# EAGLE design moja-col (EAGLE 6.4)
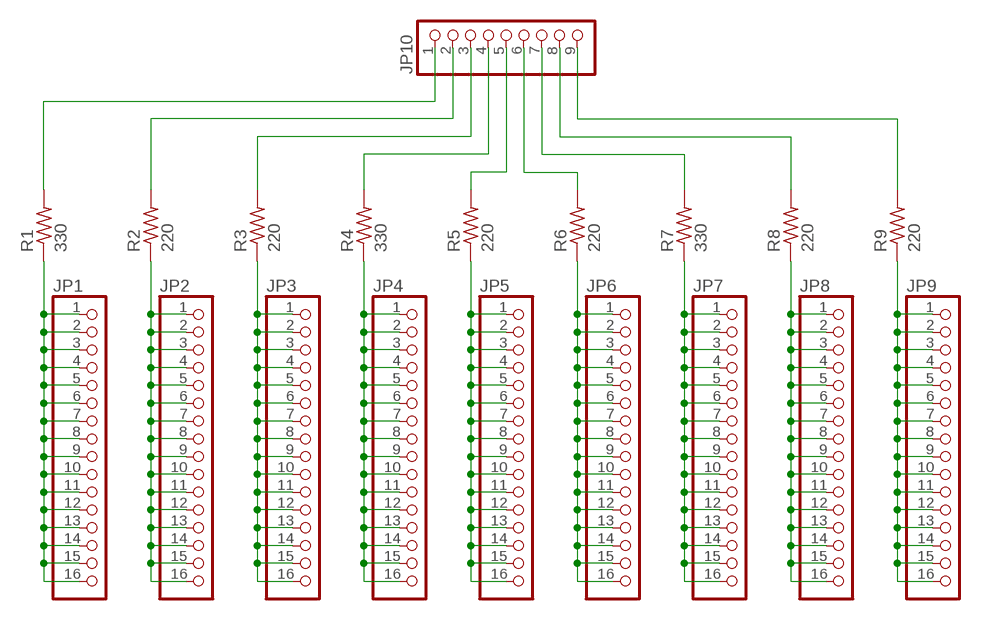
[diagram p0: schematic, sheet 1]

## Parts
JP1  PINHD-1X16  [1X16]
JP2  PINHD-1X16  [1X16]
JP3  PINHD-1X16  [1X16]
JP4  PINHD-1X16  [1X16]
JP5  PINHD-1X16  [1X16]
JP6  PINHD-1X16  [1X16]
JP7  PINHD-1X16  [1X16]
JP8  PINHD-1X16  [1X16]
JP9  PINHD-1X16  [1X16]
JP10  PINHD-1X9  [1X09]
R1  330  R-US_0204/2V  [0204V]
R2  220  R-US_0204/2V  [0204V]
R3  220  R-US_0204/2V  [0204V]
R4  330  R-US_0204/2V  [0204V]
R5  220  R-US_0204/2V  [0204V]
R6  220  R-US_0204/2V  [0204V]
R7  330  R-US_0204/2V  [0204V]
R8  220  R-US_0204/2V  [0204V]
R9  220  R-US_0204/2V  [0204V]

## Nets
N$1: JP1.1 JP1.2 JP1.3 JP1.4 JP1.5 JP1.6 JP1.7 JP1.8 JP1.9 JP1.10 JP1.11 JP1.12 JP1.13 JP1.14 JP1.15 JP1.16 R1.1
N$2: JP2.1 JP2.2 JP2.3 JP2.4 JP2.5 JP2.6 JP2.7 JP2.8 JP2.9 JP2.10 JP2.11 JP2.12 JP2.13 JP2.14 JP2.15 JP2.16 R2.1
N$3: JP3.1 JP3.2 JP3.3 JP3.4 JP3.5 JP3.6 JP3.7 JP3.8 JP3.9 JP3.10 JP3.11 JP3.12 JP3.13 JP3.14 JP3.15 JP3.16 R3.1
N$4: JP4.1 JP4.2 JP4.3 JP4.4 JP4.5 JP4.6 JP4.7 JP4.8 JP4.9 JP4.10 JP4.11 JP4.12 JP4.13 JP4.14 JP4.15 JP4.16 R4.1
N$5: JP5.1 JP5.2 JP5.3 JP5.4 JP5.5 JP5.6 JP5.7 JP5.8 JP5.9 JP5.10 JP5.11 JP5.12 JP5.13 JP5.14 JP5.15 JP5.16 R5.1
N$6: JP6.1 JP6.2 JP6.3 JP6.4 JP6.5 JP6.6 JP6.7 JP6.8 JP6.9 JP6.10 JP6.11 JP6.12 JP6.13 JP6.14 JP6.15 JP6.16 R6.1
N$7: JP7.1 JP7.2 JP7.3 JP7.4 JP7.5 JP7.6 JP7.7 JP7.8 JP7.9 JP7.10 JP7.11 JP7.12 JP7.13 JP7.14 JP7.15 JP7.16 R7.1
N$8: JP8.1 JP8.2 JP8.3 JP8.4 JP8.5 JP8.6 JP8.7 JP8.8 JP8.9 JP8.10 JP8.11 JP8.12 JP8.13 JP8.14 JP8.15 JP8.16 R8.1
N$9: JP9.1 JP9.2 JP9.3 JP9.4 JP9.5 JP9.6 JP9.7 JP9.8 JP9.9 JP9.10 JP9.11 JP9.12 JP9.13 JP9.14 JP9.15 JP9.16 R9.1
N$10: JP10.1 R1.2
N$11: JP10.2 R2.2
N$12: JP10.3 R3.2
N$13: JP10.4 R4.2
N$14: JP10.5 R5.2
N$15: JP10.6 R6.2
N$16: JP10.7 R7.2
N$17: JP10.8 R8.2
N$18: JP10.9 R9.2

## Library data of the parts
JP1-JP9 = pinhead:PINHD-1X16: PIN HEADER
JP10 = pinhead:PINHD-1X9: PIN HEADER
R1-R9 = resistor:R-US_: RESISTOR, American symbol

## Board
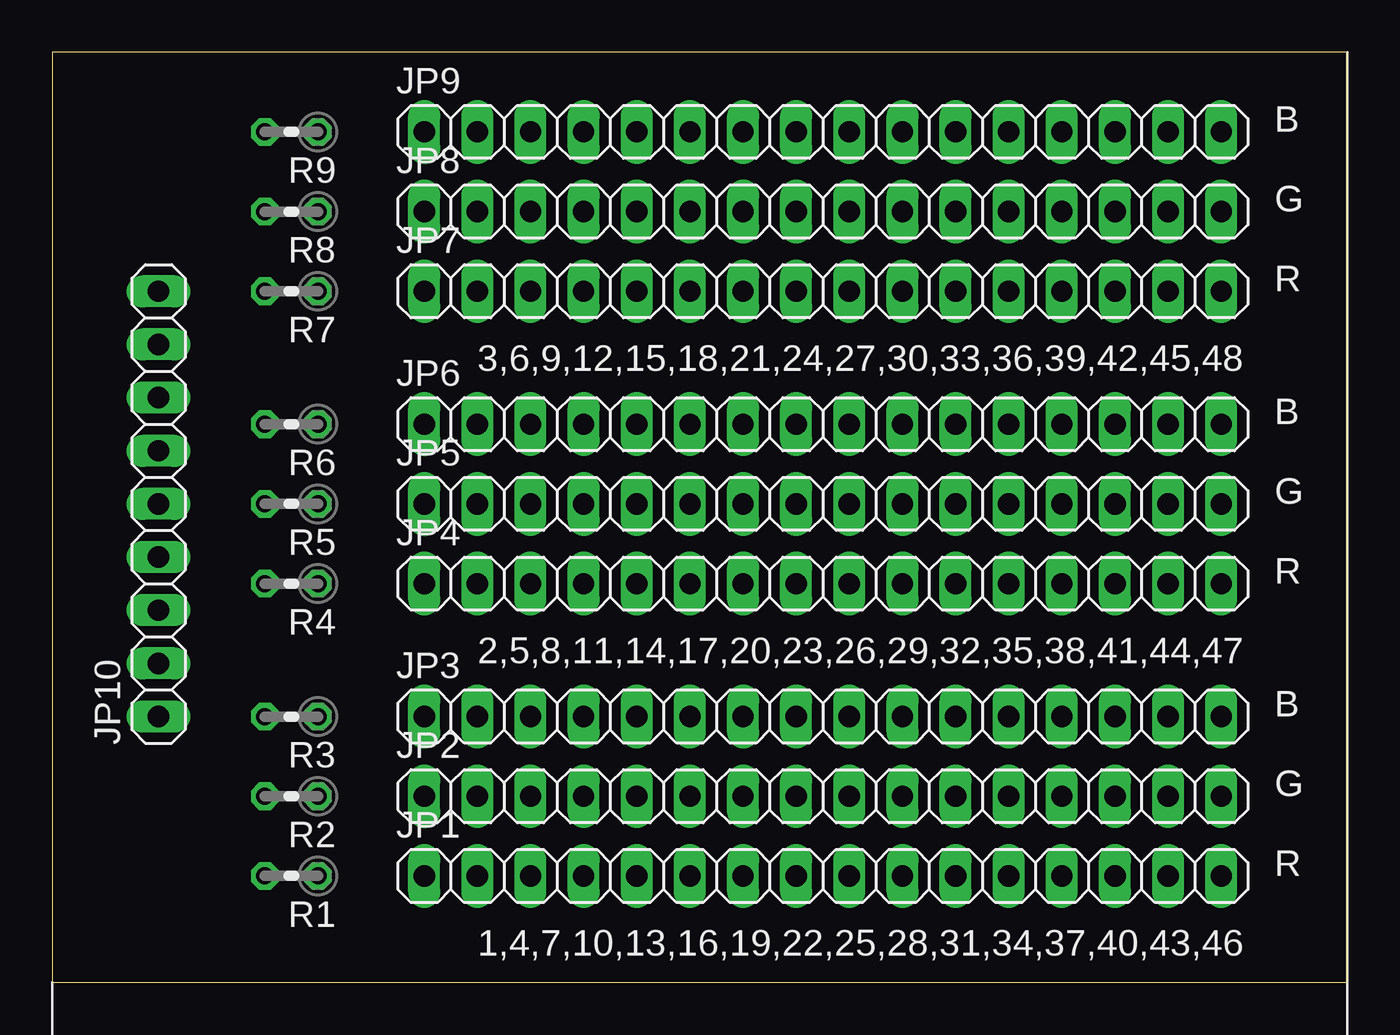
[diagram p1: board, top side]
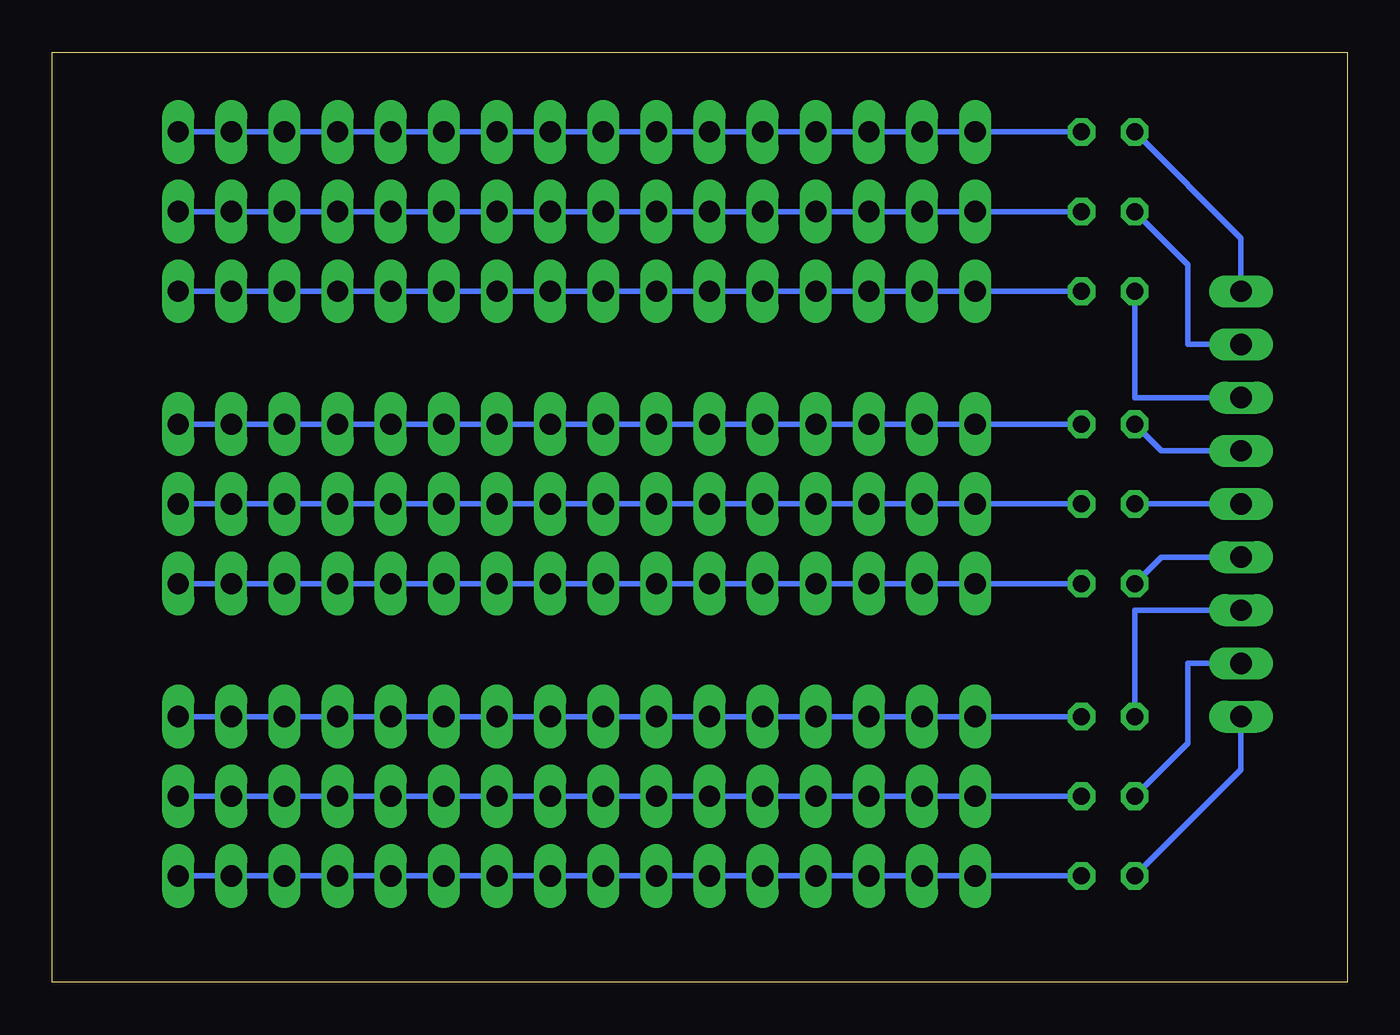
[diagram p2: board, bottom side, seen from below]

Size 61.9 x 44.44 mm. Coordinates in mm from the lower left corner, seen from the top.
Outline: 0,0 61.9,0 61.9,44.44 0,44.44 0,0
Copper layers (1*16): Top 0.035mm / dielectric 1.5mm / Bottom 0.035mm
Design rules "default": minimum track width 10mil, minimum drill 24mil, track to track 8mil, track to pad 8mil, pad to pad 8mil, via to via 8mil, smd to smd 8mil, copper to edge 40mil, drill to drill 8mil, minimum pad ring 10mil, minimum via ring 8mil, stop-mask expansion 4mil, vias tented up to drill 0mil, thermal gap 10mil

### Footprints (pad centres in the part's own frame; a part is rotated, then mirrored left to right if it is on the bottom)
1X16 = drill 1.016 long: 1 -19.05,0; 2 -16.51,0; 3 -13.97,0; 4 -11.43,0; 5 -8.89,0; 6 -6.35,0; 7 -3.81,0; 8 -1.27,0; 9 1.27,0; 10 3.81,0; 11 6.35,0; 12 8.89,0; 13 11.43,0; 14 13.97,0; 15 16.51,0; 16 19.05,0
1X09 = drill 1.016 long: 1 -10.16,0; 2 -7.62,0; 3 -5.08,0; 4 -2.54,0; 5 0,0; 6 2.54,0; 7 5.08,0; 8 7.62,0; 9 10.16,0
0204V = drill 0.813 octagon: 1 -1.27,0; 2 1.27,0

### Placement (x,y rotation side)
JP1  36.83,5.08 0 top
JP2  36.83,8.89 0 top
JP3  36.83,12.7 0 top
JP4  36.83,19.05 0 top
JP5  36.83,22.86 0 top
JP6  36.83,26.67 0 top
JP7  36.83,33.02 0 top
JP8  36.83,36.83 0 top
JP9  36.83,40.64 0 top
JP10  5.08,22.86 90 top
R1  11.43,5.08 180 top
R2  11.43,8.89 180 top
R3  11.43,12.7 180 top
R4  11.43,19.05 180 top
R5  11.43,22.86 180 top
R6  11.43,26.67 180 top
R7  11.43,33.02 180 top
R8  11.43,36.83 180 top
R9  11.43,40.64 180 top

### Tracks (layer width: path | path; a pad name or v marks a point on that pad's centre or on a via)
N$1
  Bottom 0.254: R1.1 JP1.1 JP1.2 JP1.3 JP1.4 JP1.5 JP1.6 JP1.7 JP1.8 JP1.9 JP1.10 JP1.11 JP1.12 JP1.13 JP1.14 JP1.15 JP1.16
N$2
  Bottom 0.254: R2.1 JP2.1 JP2.2 JP2.3 JP2.4 JP2.5 JP2.6 JP2.7 JP2.8 JP2.9 JP2.10 JP2.11 JP2.12 JP2.13 JP2.14 JP2.15 JP2.16
N$3
  Bottom 0.254: R3.1 JP3.1 JP3.2 JP3.3 JP3.4 JP3.5 JP3.6 JP3.7 JP3.8 JP3.9 JP3.10 JP3.11 JP3.12 JP3.13 JP3.14 JP3.15 JP3.16
N$4
  Bottom 0.254: R4.1 JP4.1 JP4.2 JP4.3 JP4.4 JP4.5 JP4.6 JP4.7 JP4.8 JP4.9 JP4.10 JP4.11 JP4.12 JP4.13 JP4.14 JP4.15 JP4.16
N$5
  Bottom 0.254: R5.1 JP5.1 JP5.2 JP5.3 JP5.4 JP5.5 JP5.6 JP5.7 JP5.8 JP5.9 JP5.10 JP5.11 JP5.12 JP5.13 JP5.14 JP5.15 JP5.16
N$6
  Bottom 0.254: R6.1 JP6.1 JP6.2 JP6.3 JP6.4 JP6.5 JP6.6 JP6.7 JP6.8 JP6.9 JP6.10 JP6.11 JP6.12 JP6.13 JP6.14 JP6.15 JP6.16
N$7
  Bottom 0.254: R7.1 JP7.1 JP7.2 JP7.3 JP7.4 JP7.5 JP7.6 JP7.7 JP7.8 JP7.9 JP7.10 JP7.11 JP7.12 JP7.13 JP7.14 JP7.15 JP7.16
N$8
  Bottom 0.254: R8.1 JP8.1 JP8.2 JP8.3 JP8.4 JP8.5 JP8.6 JP8.7 JP8.8 JP8.9 JP8.10 JP8.11 JP8.12 JP8.13 JP8.14 JP8.15 JP8.16
N$9
  Bottom 0.254: R9.1 JP9.1 JP9.2 JP9.3 JP9.4 JP9.5 JP9.6 JP9.7 JP9.8 JP9.9 JP9.10 JP9.11 JP9.12 JP9.13 JP9.14 JP9.15 JP9.16
N$10
  Bottom 0.254: R1.2 5.08,10.16 JP10.1
N$11
  Bottom 0.254: R2.2 7.62,11.43 7.62,15.24 JP10.2
N$12
  Bottom 0.254: R3.2 10.16,17.78 JP10.3
N$13
  Bottom 0.254: R4.2 8.89,20.32 JP10.4
N$14
  Bottom 0.254: JP10.5 R5.2
N$15
  Bottom 0.254: R6.2 8.89,25.4 JP10.6
N$16
  Bottom 0.254: R7.2 10.16,27.94 JP10.7
N$17
  Bottom 0.254: R8.2 7.62,34.29 7.62,30.48 JP10.8
N$18
  Bottom 0.254: R9.2 5.08,35.56 JP10.9

### Text on the board
tPlace: B | G | R | 3,6,9,12,15,18,21,24,27,30,33,36,39,42,45,48 | B | G | R | 2,5,8,11,14,17,20,23,26,29,32,35,38,41,44,47 | B | G | R | 1,4,7,10,13,16,19,22,25,28,31,34,37,40,43,46